# EasyEDA schematic schematic.json
TITLE: Parrot; REV: 1.0; Date: 2019-01-28; Sheet: 1/1; Drawn By: tardate; Company: Your Company
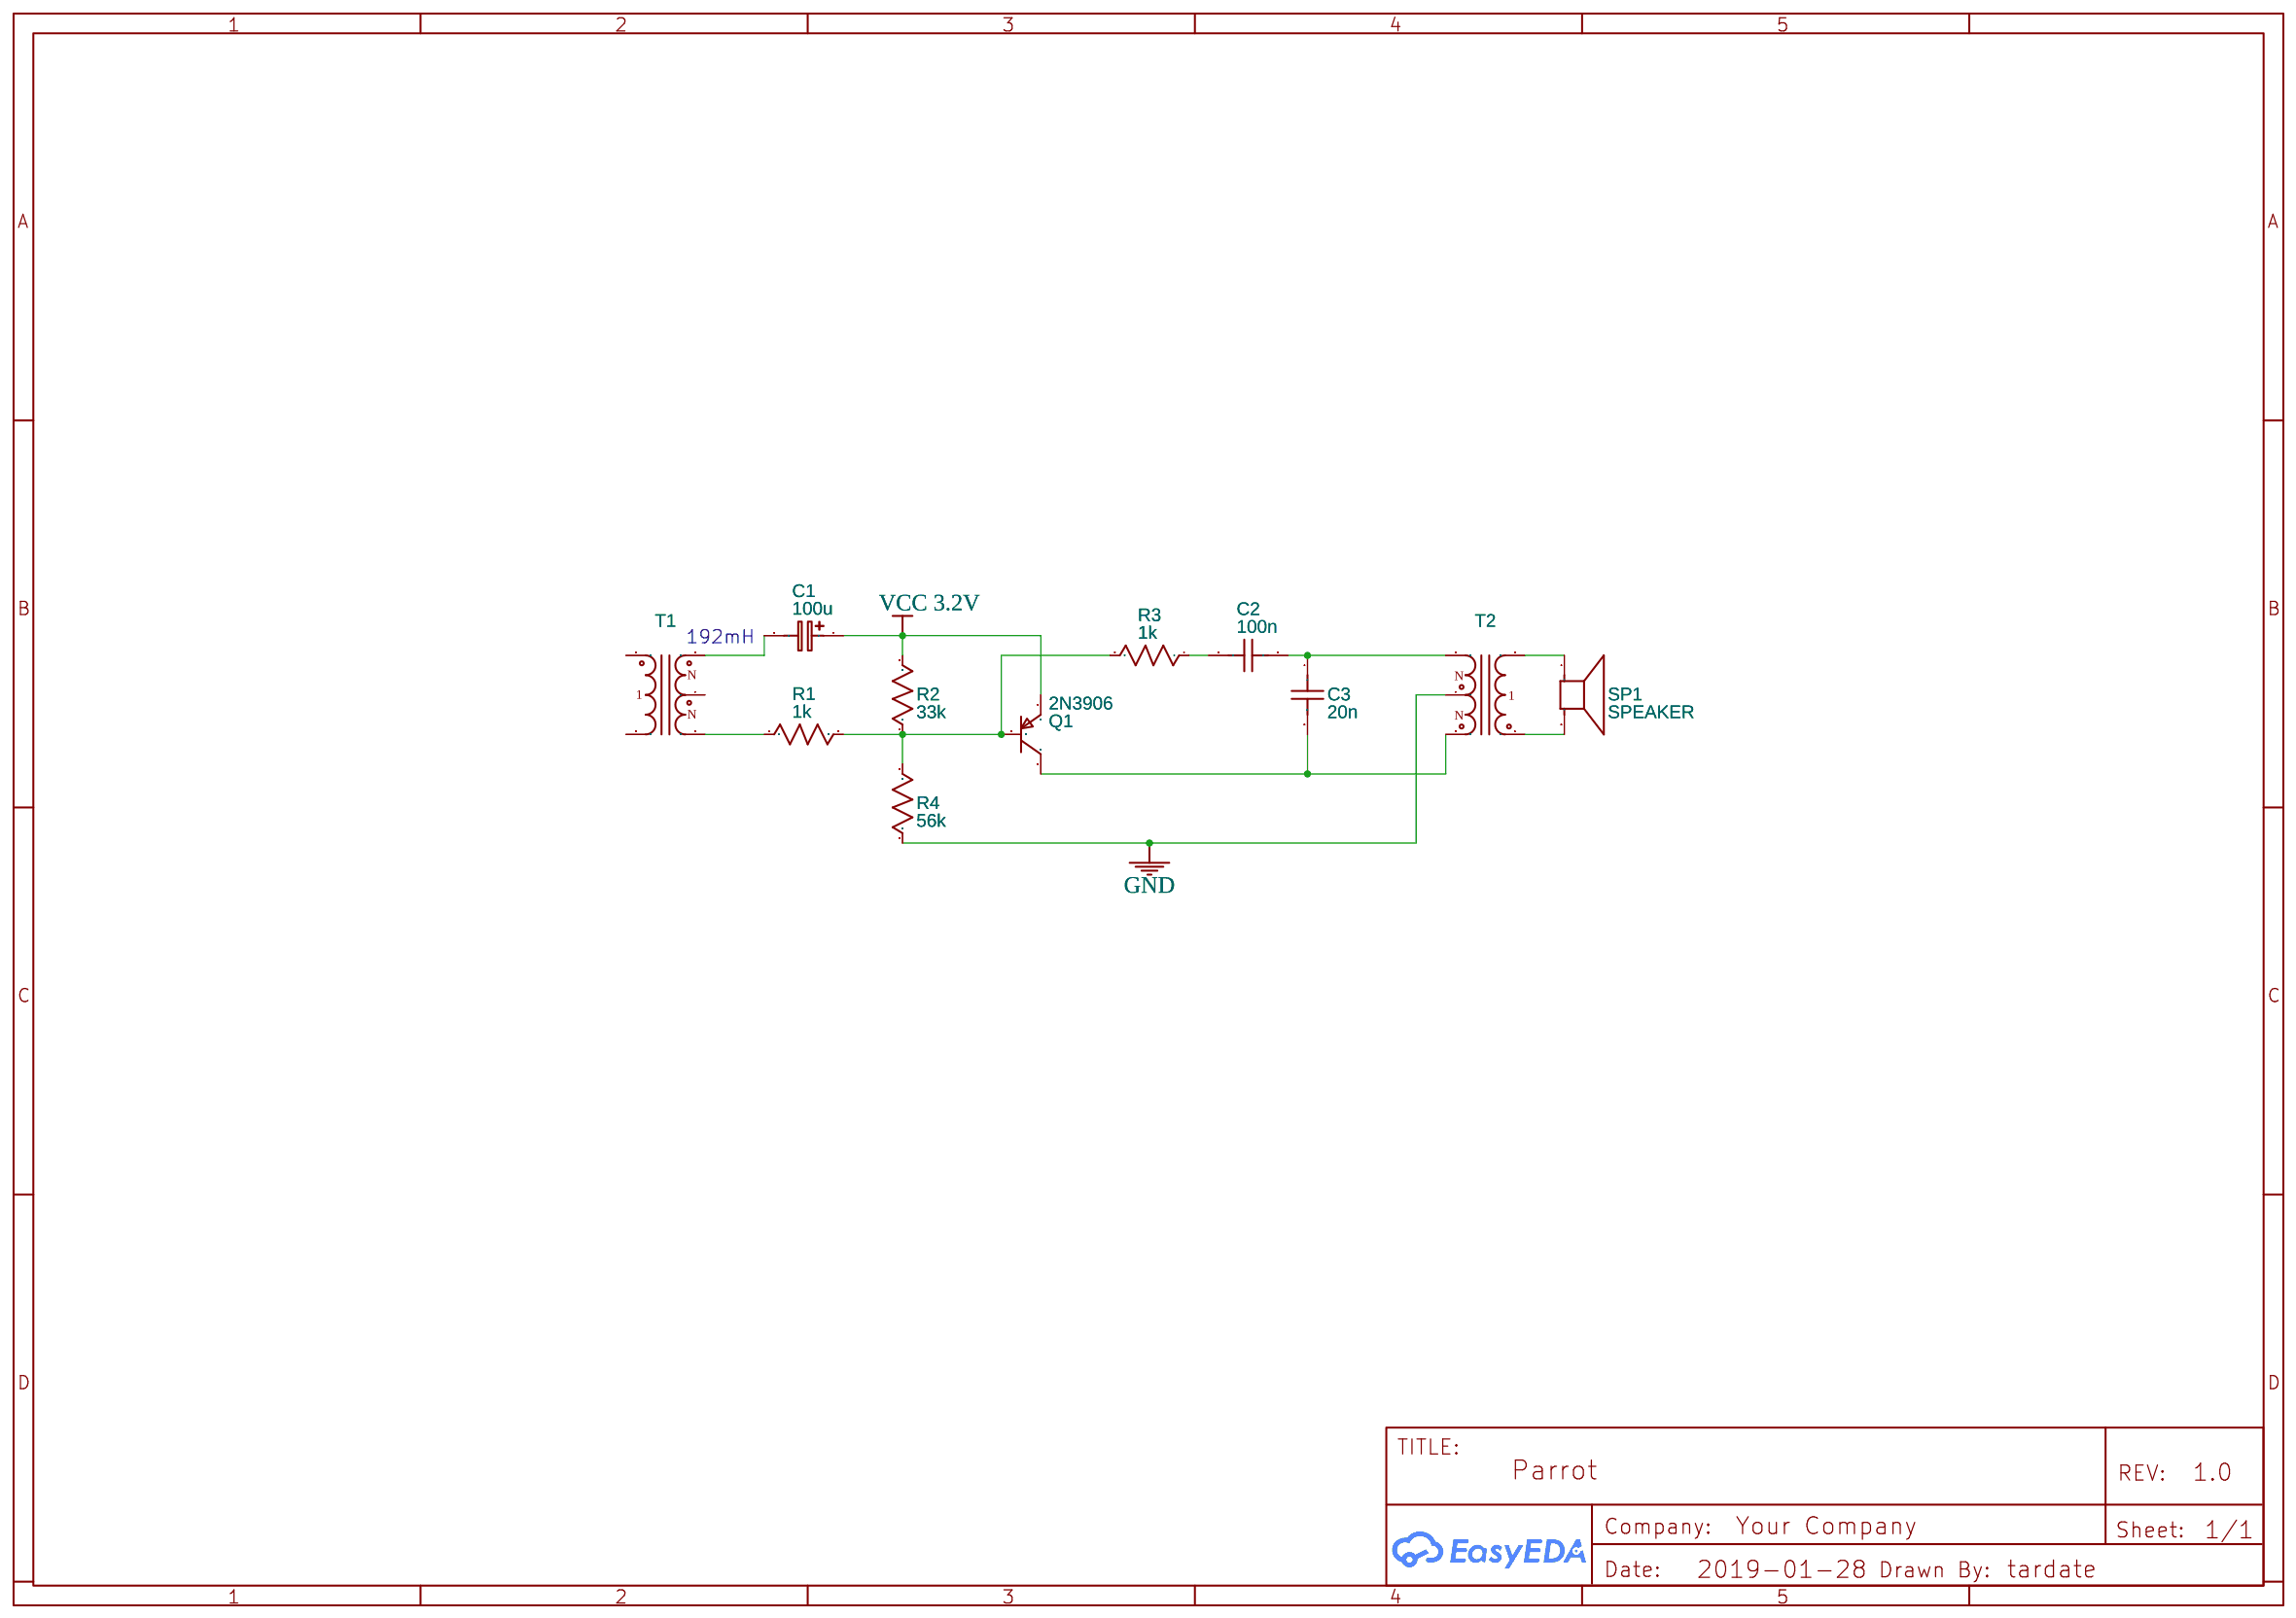
[diagram p0: schematic sheet]

## Parts
C1  100u  [CAP-D3.0XF1.5]
C2  100n  [RAD-0.1]
C3  20n  [RAD-0.1]
Q1  2N3906  [TO-92(TO-92-3)]
R1  1k  [AXIAL-0.3]
R2  33k  [AXIAL-0.3]
R3  1k  [AXIAL-0.3]
R4  56k  [AXIAL-0.3]
SP1  SPEAKER  [AL60P]
T1  TRANSFORMER_CENTRE_TAPPED_US
T2  TRANSFORMER_CENTRE_TAPPED_US

## Library data of the parts
C1 = Cap_Electrolytic(TH)_D3.0XF1.5_EU: Contributor: EasyEDA; Manufacturer Part: ?
C2 C3 = Cap_RAD-0.1_US: Manufacturer Part: ?
Q1 = -: Supplier: LCSC; Manufacturer: CJ; image: //image.lceda.cn/szlcsc/C9809.jpg; Supplier Part: C9809
R1-R4 = Res_AXIAL-0.3(1/8W)_US: Manufacturer Part: ?
SP1 = -: Contributor: Adafruit; Manufacturer Part: ?
T1 T2 = -: RATIO: 2; Manufacturer Part: ?

## Nets
GND: R4.1 T2.4
VCC 3.2V: C1.1 Q1.1(E) R2.2
Net-(C1-2): C1.2 T1.5
Net-(C2-1): C2.1 C3.1 T2.3
Net-(C2-2): C2.2 R3.1
Net-(C3-2): C3.2 Q1.3(C) T2.5
Net-(Q1-2): Q1.2(B) R1.2 R2.1 R3.2 R4.2
Net-(R1-1): R1.1 T1.3
Net-(SP1-1): SP1.1(+) T2.2
Net-(SP1-2): SP1.2(-) T2.1

Not connected (* = marked no-connect by the designer): T1 1 2 4

## Notes on the sheet
- 192mH
